# Altium schematic sheet TP_IHM_POWER.SchDoc
size A4
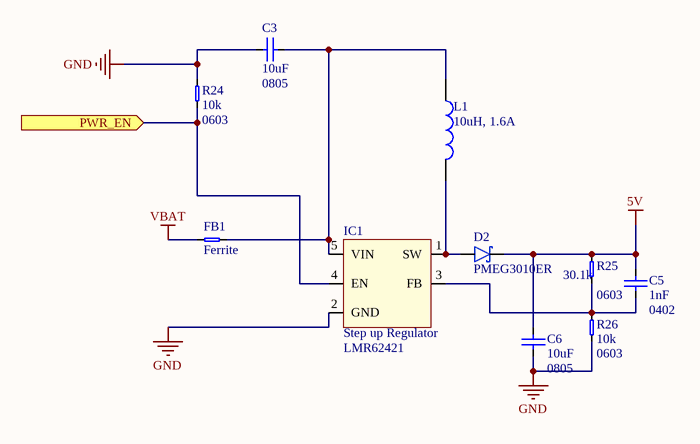
[diagram p0: TP_IHM_POWER.SchDoc]

## Parts
C3  value 10uF  Package: 0805  [0805_CAP_LD]  (hidden comment: CerCap)
C5  value 1nF  Package: 0402  [0402_CAP_LD]  (hidden comment: CerCap)
C6  value 10uF  Package: 0805  [0805_CAP_LD]  (hidden comment: CerCap)
D2  PMEG3010ER  [SOD123W]
FB1  Ferrite  [0603_FER_LD]
IC1  Step up Regulator  [LMR62421]
L1  10uH, 1.6A  [INDUCTOR_WE-LQS_5020]
R24  value 10k  Package: 0603  [0603_RES_LD]  (hidden comment: Resistor)
R25  value 30.1k  Package: 0603  [0603_RES_LD]  (hidden comment: Resistor)
R26  value 10k  Package: 0603  [0603_RES_LD]  (hidden comment: Resistor)

## Ports
PWR_EN (in)

## Nets
5V: C5.1 C6.1 D2.K R25.2
GND: C3.2 C6.2 IC1.2(GND) R24.2 R26.1
VBAT: FB1.2
PWR_EN: IC1.4(EN) R24.1 ; port PWR_EN
NetC3_1: C3.1 FB1.1 IC1.5(VIN) L1.1
NetC5_2: C5.2 IC1.3(FB) R25.1 R26.2
NetD2_A: D2.A IC1.1(SW) L1.2

## Library data of the parts
C3 C5 C6 = CerCap: Ceramic Capacitor; Type: *; Voltage/Power: *
D2 = Schottky_PMEG3010ER: Nexperia 1A low Vf Mega Schottky barrier rectifier; Reference: PMEG3010ER
FB1 = Ferrite: Ferrite Bead
IC1 = LMR62421XMF: LMR62421 simple switcher 24 Vout stepup voltage SOT-23; Reference: LMR62421
L1 = INDUCTOR_74404052100: WE-LQS SMD Power Inductor, size 5020, 10uH, 1.6A; DC Resistance: 109mOhm; Inductance Tolerance: +/-20%; Saturation Current: 1.95A; Self Resonant Frequency: 37MHz; ComponentLink1Description: Manufacturer; ComponentLink1URL: http://www.we-online.de; ComponentLink2Description: Datasheet; ComponentLink2URL: https://katalog.we-online.com/pbs/datasheet/74404052100.pdf; Part Number: 74404052100; Published Date: May 2019; Publisher: Wurth Elektronik; Rated Current: 1.6A; Inductance: 10uH; Operating Temperature: -40 to +125degC; Mounting Technology: SMT; Packaging: Tape and Reel; DC Resistance Tolerance: +/-20%; Size: 5020; Reference: 74404052100
R24-R26 = Resistor: Precision: *